# EAGLE schematic MicroUSB Adapter (EAGLE 9.5.1)
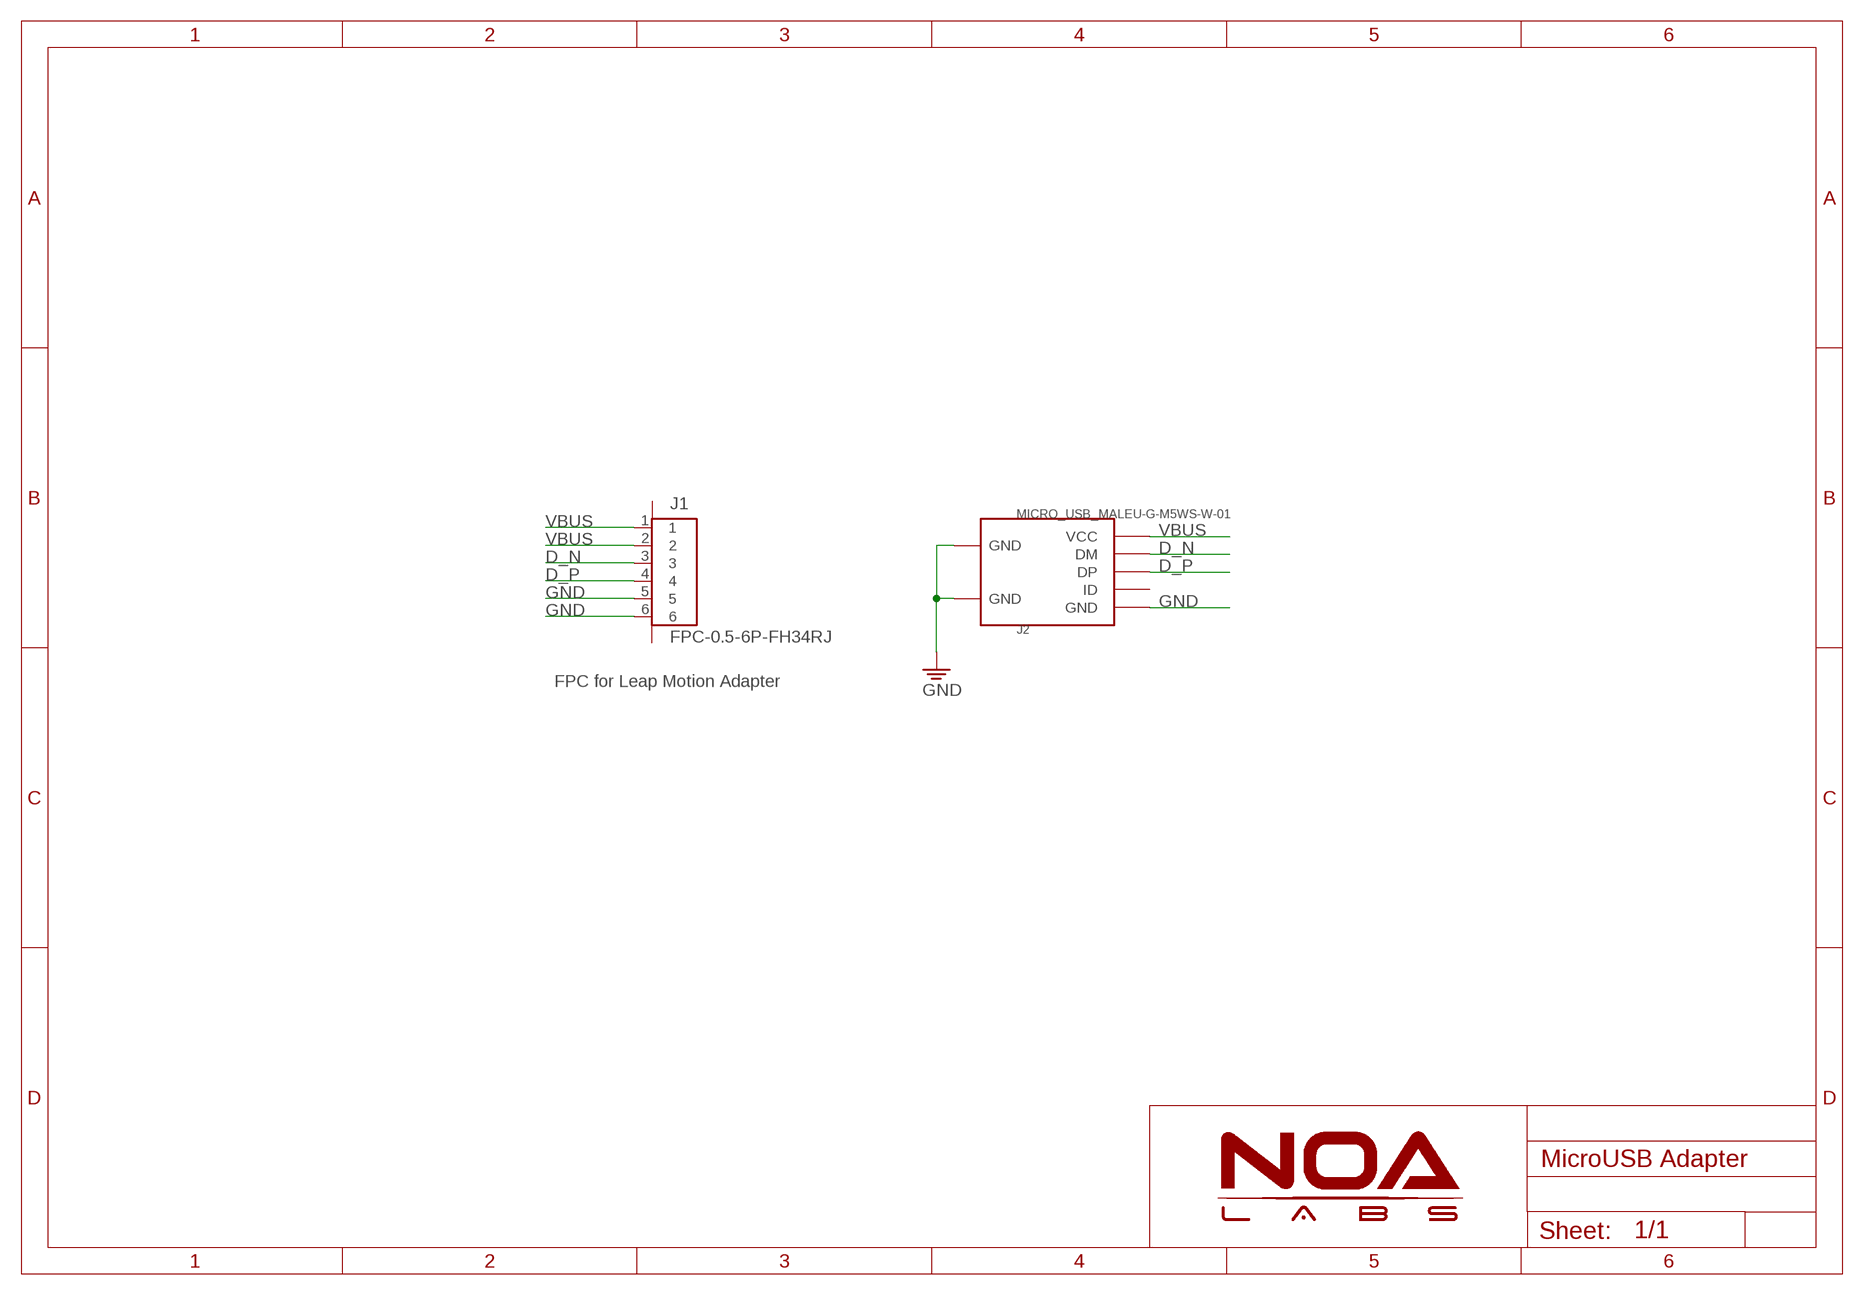
[diagram p0: schematic, sheet 1]

## Parts
J1  FPC-0.5-6P-FH34RJ  [FH34RJ-6S]
J2  MICRO_USB_MALEU-G-M5WS-W-01  [U-G-M5WS-W-01]

## Nets
D_N [Diff]: J1.3 J2.2(DM)
D_P [Diff]: J1.4 J2.3(DP)
GND: J1.5 J1.6 J2.5(GND) J2.P$6(GND) J2.P$7(GND)
VBUS: J1.1 J1.2 J2.1(VCC)
Unconnected: J1.MH1(G1) J1.MH2(G2) J2.4(ID)

## Notes on the sheet
- FPC for Leap Motion Adapter

## Library data of the parts
J1 = Connector_NOA:FPC-0.5-6P
J2 = Connector:MICRO_USB_MALE

## Net classes
0 Normal: width 0.102 mm, drill 0.2 mm, clearance 0.102 mm
2 Diff: width 0.293 mm, drill 0.2 mm, clearance 0.508 mm to class 0, clearance 0.508 mm to class 1, clearance 0.102 mm